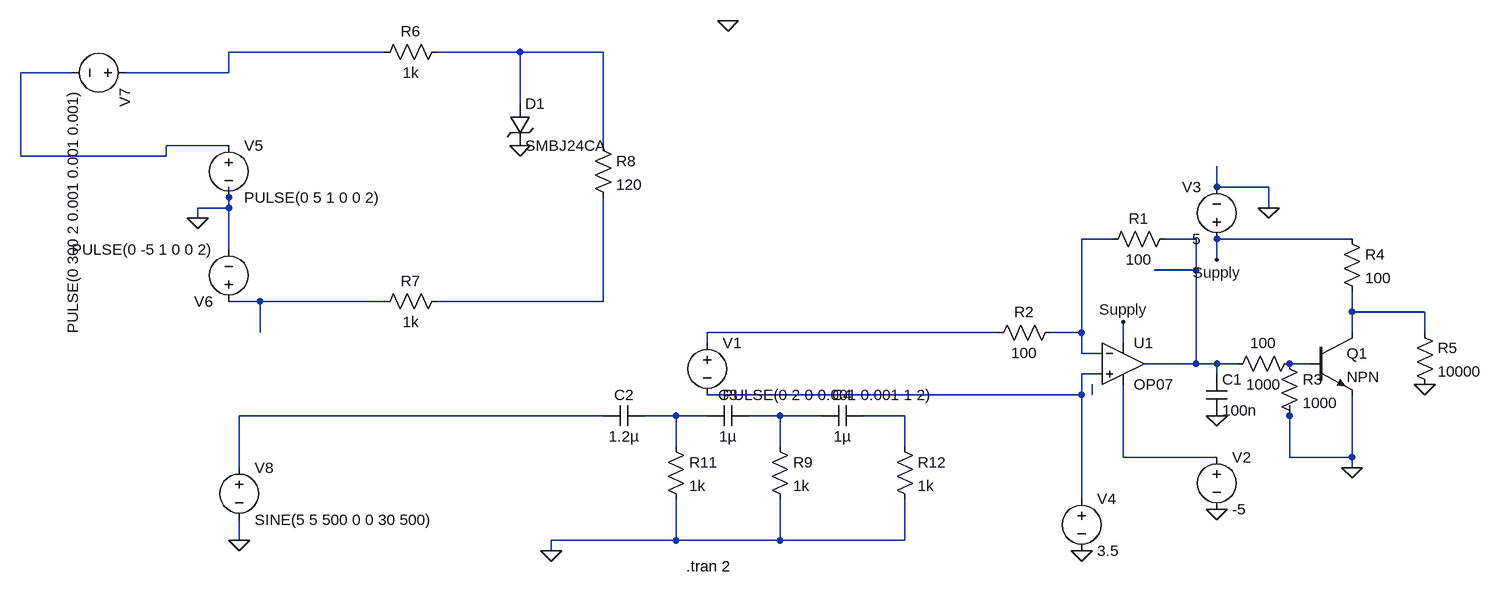
[diagram p0: schematic Differential.asc]
Differential.asc, the LTspice schematic file:
Version 4
SHEET 1 960 680
WIRE -736 -384 -976 -384
WIRE -528 -384 -656 -384
WIRE -400 -384 -528 -384
WIRE -1216 -352 -1296 -352
WIRE -976 -352 -976 -384
WIRE -976 -352 -1136 -352
WIRE -528 -304 -528 -384
WIRE -976 -240 -1072 -240
WIRE -400 -240 -400 -384
WIRE -1296 -224 -1296 -352
WIRE -1072 -224 -1072 -240
WIRE -1072 -224 -1296 -224
WIRE 544 -176 544 -208
WIRE 624 -176 544 -176
WIRE -976 -160 -976 -176
WIRE -976 -144 -976 -160
WIRE -976 -144 -1024 -144
WIRE 624 -144 624 -176
WIRE -1024 -128 -1024 -144
WIRE 384 -96 336 -96
WIRE 512 -96 464 -96
WIRE 752 -96 544 -96
WIRE -976 -80 -976 -144
WIRE 544 -64 544 -96
WIRE 512 -48 512 -96
WIRE 512 -48 448 -48
WIRE -928 0 -976 0
WIRE -736 0 -928 0
WIRE -400 0 -400 -160
WIRE -400 0 -656 0
WIRE 752 16 752 -16
WIRE 864 16 752 16
WIRE -928 48 -928 0
WIRE 208 48 -240 48
WIRE 336 48 336 -96
WIRE 336 48 288 48
WIRE 752 48 752 16
WIRE 864 48 864 16
WIRE -240 64 -240 48
WIRE 400 64 400 32
WIRE 336 80 336 48
WIRE 368 80 336 80
WIRE 512 96 512 -48
WIRE 512 96 432 96
WIRE 544 96 512 96
WIRE 576 96 544 96
WIRE 688 96 656 96
WIRE 368 112 336 112
WIRE 544 112 544 96
WIRE 336 144 336 112
WIRE 336 144 -240 144
WIRE 352 144 352 128
WIRE -400 176 -960 176
WIRE -288 176 -336 176
WIRE -240 176 -288 176
WIRE -128 176 -176 176
WIRE -64 176 -128 176
WIRE 64 176 0 176
WIRE 656 176 656 160
WIRE -288 224 -288 176
WIRE -128 224 -128 176
WIRE 64 224 64 176
WIRE 400 240 400 128
WIRE 544 240 400 240
WIRE 656 240 656 176
WIRE 752 240 752 144
WIRE 752 240 656 240
WIRE -960 256 -960 176
WIRE 752 256 752 240
WIRE 336 304 336 144
WIRE -960 368 -960 336
WIRE -288 368 -288 304
WIRE -288 368 -480 368
WIRE -128 368 -128 304
WIRE -128 368 -288 368
WIRE 64 368 64 304
WIRE 64 368 -128 368
WIRE -480 384 -480 368
FLAG 624 -144 0
FLAG 544 320 0
FLAG 336 384 0
FLAG 544 -64 Supply
FLAG 400 32 Supply
FLAG 752 256 0
FLAG 864 128 0
FLAG -1024 -128 0
FLAG -208 -432 0
FLAG -528 -240 0
FLAG 544 176 0
FLAG -960 368 0
FLAG -480 384 0
SYMBOL voltage -240 48 R0
WINDOW 123 0 0 Left 0
WINDOW 39 0 0 Left 0
SYMATTR InstName V1
SYMATTR Value PULSE(0 2 0 0.001 0.001 1 2)
SYMBOL voltage 544 224 R0
WINDOW 123 0 0 Left 0
WINDOW 39 0 0 Left 0
SYMATTR InstName V2
SYMATTR Value -5
SYMBOL voltage 544 -80 R180
WINDOW 0 24 96 Left 2
WINDOW 3 24 16 Left 2
WINDOW 123 0 0 Left 0
WINDOW 39 0 0 Left 0
SYMATTR InstName V3
SYMATTR Value 5
SYMBOL voltage 336 288 R0
WINDOW 123 0 0 Left 0
WINDOW 39 0 0 Left 0
SYMATTR InstName V4
SYMATTR Value 3.5
SYMBOL Opamps\\OP07 400 32 R0
SYMATTR InstName U1
SYMBOL res 480 -112 R90
WINDOW 0 0 56 VBottom 2
WINDOW 3 32 56 VTop 2
SYMATTR InstName R1
SYMATTR Value 100
SYMBOL res 304 32 R90
WINDOW 0 0 56 VBottom 2
WINDOW 3 32 56 VTop 2
SYMATTR InstName R2
SYMATTR Value 100
SYMBOL npn 688 48 R0
SYMATTR InstName Q1
SYMBOL res 672 80 R90
WINDOW 0 0 56 VBottom 2
WINDOW 3 32 56 VTop 2
SYMATTR InstName 100
SYMATTR Value 1000
SYMBOL res 640 80 R0
SYMATTR InstName R3
SYMATTR Value 1000
SYMBOL res 848 32 R0
SYMATTR InstName R5
SYMATTR Value 10000
SYMBOL res 736 -112 R0
SYMATTR InstName R4
SYMATTR Value 100
SYMBOL voltage -976 -256 R0
WINDOW 123 0 0 Left 0
WINDOW 39 0 0 Left 0
SYMATTR InstName V5
SYMATTR Value PULSE(0 5 1 0 0 2)
SYMBOL voltage -976 16 R180
WINDOW 123 0 0 Left 0
WINDOW 39 0 0 Left 0
SYMATTR InstName V6
SYMATTR Value PULSE(0 -5 1 0 0 2)
SYMBOL res -640 -400 R90
WINDOW 0 0 56 VBottom 2
WINDOW 3 32 56 VTop 2
SYMATTR InstName R6
SYMATTR Value 1k
SYMBOL res -640 -16 R90
WINDOW 0 0 56 VBottom 2
WINDOW 3 32 56 VTop 2
SYMATTR InstName R7
SYMATTR Value 1k
SYMBOL TVSdiode -544 -304 R0
WINDOW 0 24 0 Left 2
WINDOW 3 24 64 Left 2
SYMATTR InstName D1
SYMATTR Value SMBJ24CA
SYMATTR Description Diode
SYMATTR Type diode
SYMBOL res -416 -256 R0
SYMATTR InstName R8
SYMATTR Value 120
SYMBOL voltage -1120 -352 R90
WINDOW 123 0 0 Left 0
WINDOW 39 0 0 Left 0
SYMATTR InstName V7
SYMATTR Value PULSE(0 300 2 0.001 0.001 0.001)
SYMBOL cap 528 112 R0
SYMATTR InstName C1
SYMATTR Value 100n
SYMBOL voltage -960 240 R0
WINDOW 123 0 0 Left 0
WINDOW 39 0 0 Left 0
SYMATTR InstName V8
SYMATTR Value SINE(5 5 500 0 0 30 500)
SYMBOL cap -336 160 R90
WINDOW 0 0 32 VBottom 2
WINDOW 3 32 32 VTop 2
SYMATTR InstName C2
SYMATTR Value 1.2µ
SYMATTR SpiceLine V=50 Irms=3.8 Rser=0 Lser=0
SYMBOL res -304 208 R0
SYMATTR InstName R11
SYMATTR Value 1k
SYMBOL res -144 208 R0
SYMATTR InstName R9
SYMATTR Value 1k
SYMBOL cap -176 160 R90
WINDOW 0 0 32 VBottom 2
WINDOW 3 32 32 VTop 2
SYMATTR InstName C3
SYMATTR Value 1µ
SYMBOL cap 0 160 R90
WINDOW 0 0 32 VBottom 2
WINDOW 3 32 32 VTop 2
SYMATTR InstName C4
SYMATTR Value 1µ
SYMBOL res 48 208 R0
SYMATTR InstName R12
SYMATTR Value 1k
TEXT -272 408 Left 2 !.tran 2

The netlist it stands for:
* Differential.asc
V1 N009 N011 PULSE(0 2 0 0.001 0.001 1 2)
V2 N017 0 -5
V3 Supply 0 5
V4 N011 0 3.5
XU1 N011 N004 Supply N017 N005 LT1001  ; OP07, pins In+ In- V+ V- OUT
R1 N005 N004 100
R2 N004 N009 100
Q1 N008 N010 0 0 NPN
R§100 N010 N005 1000
R3 N010 0 1000
R5 N008 0 10000
R4 Supply N008 100
V5 N003 0 PULSE(0 5 1 0 0 2)
V6 N006 0 PULSE(0 -5 1 0 0 2)
R6 N002 N001 1k
R7 N007 N006 1k
D1 N002 0 SMBJ24CA
R8 N002 N007 120
V7 N001 N003 PULSE(0 300 2 0.001 0.001 0.001)
C1 N005 0 100n
V8 N013 0 SINE(5 5 500 0 0 30 500)
C2 N014 N013 1.2µ V=50 Irms=3.8 Rser=0 Lser=0
R11 N014 0 1k
R9 N015 0 1k
C3 N015 N014 1µ
C4 N016 N015 1µ
R12 N016 0 1k
.model D D
.lib standard.dio
.model NPN NPN
.model PNP PNP
.lib standard.bjt
.tran 2
.lib LTC.lib
.backanno
.end